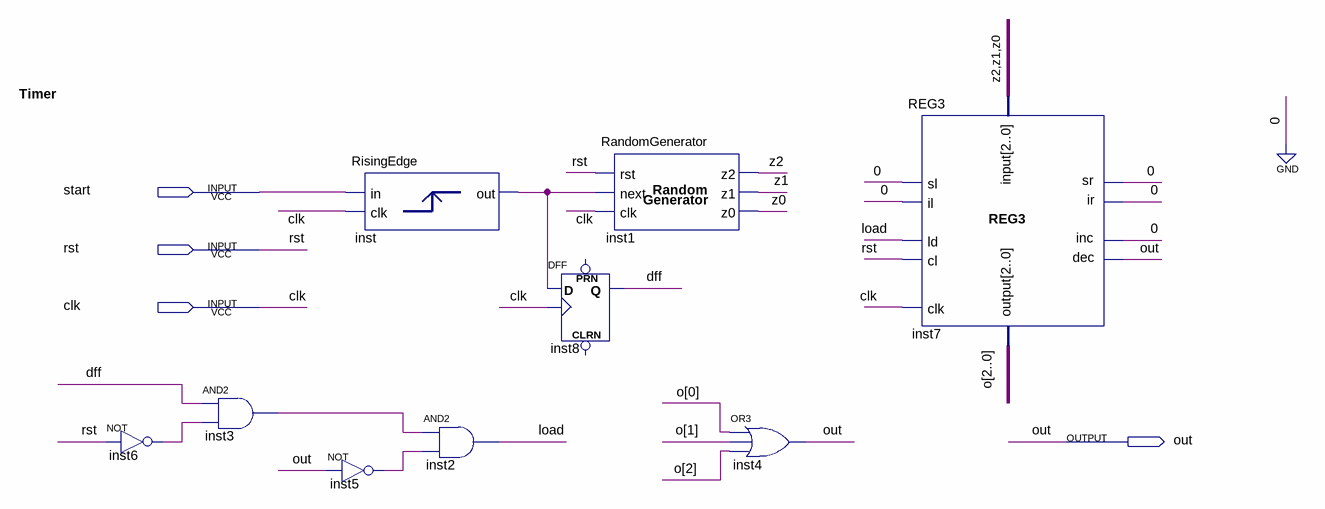
[diagram p0: schematic sheet]
// Quartus schematic Timer.bdf as structural Verilog: 9 symbols, 4 pins
module Timer (
  input  start,
  input  rst,
  input  clk,
  output out
);

  wire dff, inst3_out, inst5_out, inst6_out, inst_output, load, z0, z1, z2;
  wire [2:0] o;

  not inst6 (inst6_out, rst);
  and inst3 (inst3_out, dff, inst6_out);
  RisingEdge inst (.clk(clk), .\input (start), .\output (inst_output));
  not inst5 (inst5_out, out);
  and inst2 (load, inst3_out, inst5_out);
  RandomGenerator inst1 (.NXT(inst_output), .RST(rst), .CLK(clk), .Z2(z2), .Z1(z1), .Z0(z0));
  DFF inst8 (.CLK(clk), .D(inst_output), .Q(dff));  // open: CLRN, PRN
  or inst4 (out, o[0], o[1], o[2]);
  REG3 inst7 (
    .clk(clk), .ld(load), .\input ({z2, z1, z0}), .sr(1'b0), .ir(1'b0), .sl(1'b0), .il(1'b0), .inc(1'b0),
    .dec(out), .cl(rst), .\output (o));

  // Notes on the sheet:
  //   Timer
endmodule
